# Altium project PCB_AUTO-HANDWASH-THERMOMETER.PrjPcb
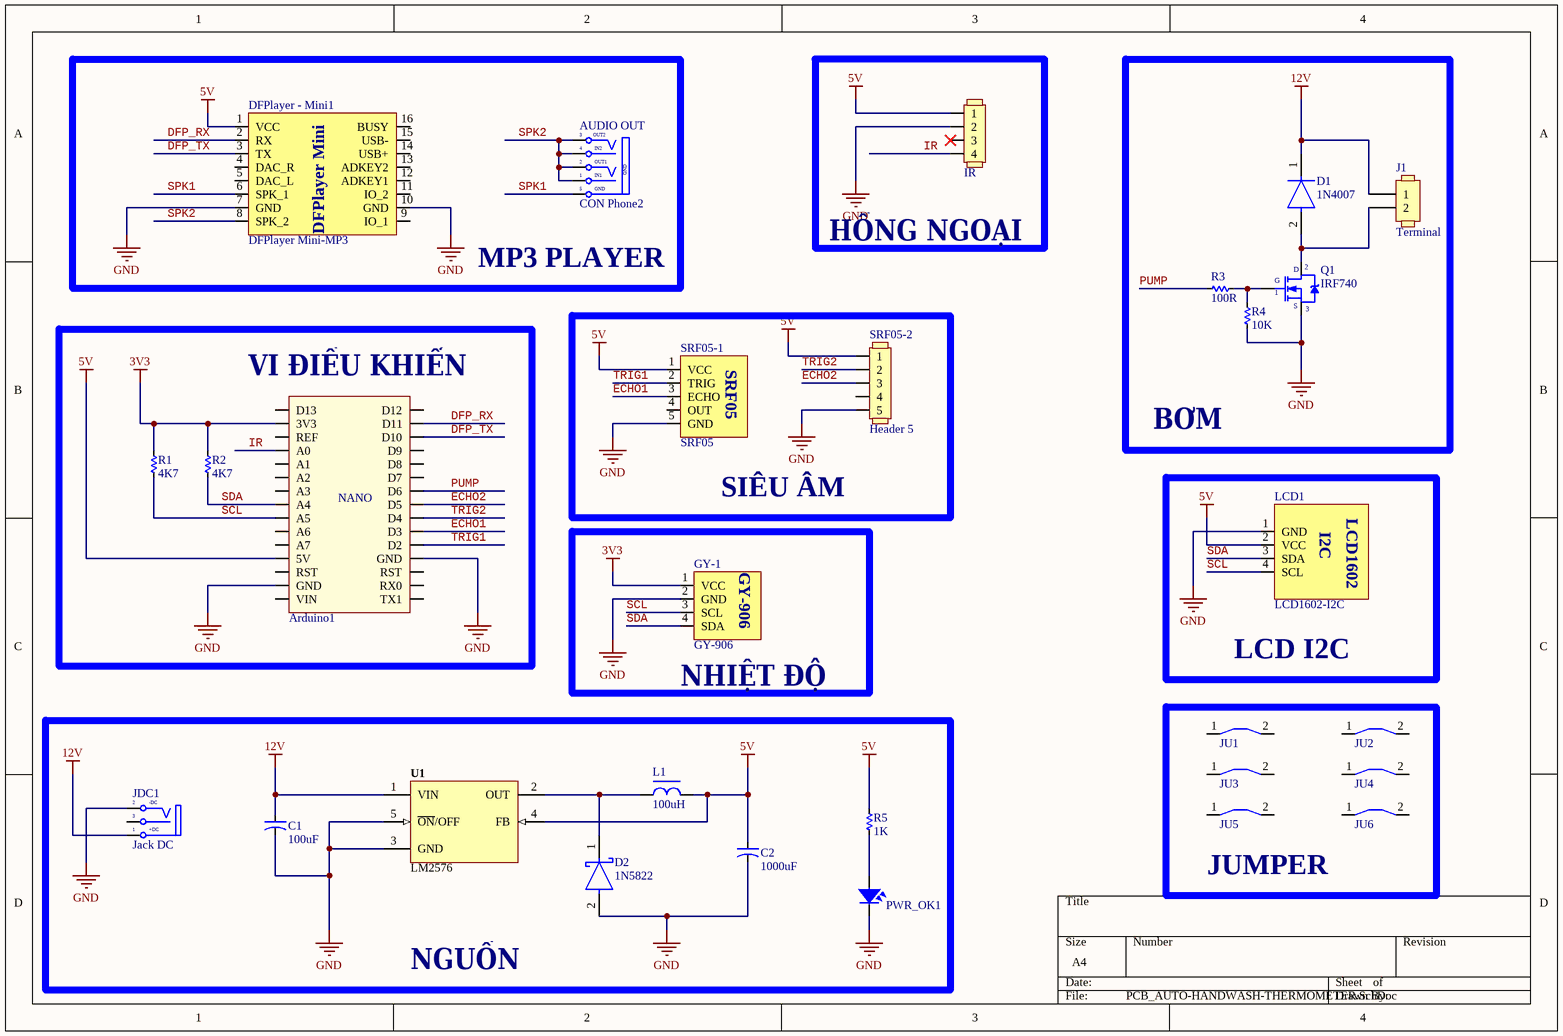
[diagram p0: PCB_AUTO-HANDWASH-THERMOMETER.SchDoc]
1 sheet, 29 parts. Net scope: global (net labels, ports and power ports of the same name join across sheets).
Board file: PCB_AUTO-HANDWASH-THERMOMETER.PcbDoc

## Sheet PCB_AUTO-HANDWASH-THERMOMETER.SchDoc
size A4; SheetNumber: 1; SheetTotal: 1

### Parts
Arduino1  Arduino Nano  [Arduino Nano]  (value not drawn)
AUDIO_OUT  CON Phone2  [CON Phone2]
C1  100uF  [CA-ALU-16]
C2  1000uF  [CA-ALU-16]
D1  1N4007  [FP-1N4007-MFG]
D2  1N5822  [FP-DO-201AD-MFG]
DFPlayer_-_Mini1  DFPlayer Mini-MP3  [DFPlayer Mini]
GY-1  GY-906  [GY-906]
IR  Header 4  [HEADER x4]  (value not drawn)
J1  Terminal  [Terminal x2 5mm]
JDC1  Jack DC  [DC0]
JU1  JUMPER  [JUMPER 15MM]  (value not drawn)
JU2  JUMPER  [JUMPER 10MM]  (value not drawn)
JU3  JUMPER  [JUMPER 5MM]  (value not drawn)
JU4  JUMPER  [JUMPER 5MM]  (value not drawn)
JU5  JUMPER  [JUMPER 5MM]  (value not drawn)
JU6  JUMPER  [JUMPER 5MM]  (value not drawn)
L1  100uH  [L-DIP-M-8]
LCD1  LCD1602-I2C  [LCD1602-I2C]
PWR_OK1  LED  [LED-5-RED]  (value not drawn)
Q1  IRF740  [TO220H1]
R1  4K7  [RES-1/4W]
R2  4K7  [RES-1/4W]
R3  100R  [RES-1/4W]
R4  10K  [RES-1/4W]
R5  1K  [RES-1/4W]
SRF05-1  SRF05  [SRF05]
SRF05-2  Header 5  [HEADER x5]
U1  LM2576  [DIP5-T]

### Blocks framed on the sheet
MP3 PLAYER: AUDIO_OUT DFPlayer_-_Mini1
HỒNG NGOẠI: IR
BƠM: D1 J1 Q1 R3 R4
VI ĐIỀU KHIỂN: Arduino1 R1 R2
SIÊU ÂM: SRF05-1 SRF05-2
LCD I2C: LCD1
NHIỆT ĐỘ: GY-1
NGUỒN: C1 C2 D2 JDC1 L1 PWR_OK1 R5 U1
JUMPER: JU1-JU6

### Nets
3V3: Arduino1.3V3 GY-1.1(VCC) R1.1 R2.1
5V: Arduino1.5V C2.1 DFPlayer_-_Mini1.1(VCC) IR.1 L1.2 LCD1.2(VCC) R5.1 SRF05-1.1(VCC) SRF05-2.1 U1.4(FB)
12V: C1.1 D1.1(C) J1.1 JDC1.1(T) U1.1(VIN)
GND: Arduino1.GND C1.2 C2.2 D2.2(A) DFPlayer_-_Mini1.7(GND) DFPlayer_-_Mini1.10(GND) GY-1.2(GND) IR.2 JDC1.2(TN) LCD1.1(GND) PWR_OK1.2 Q1.3(S) R4.2 SRF05-1.5(GND) SRF05-2.5 U1.3(GND) U1.5(~{ON}/OFF)
DFP_RX: Arduino1.D11 DFPlayer_-_Mini1.2(RX)
DFP_TX: Arduino1.D10 DFPlayer_-_Mini1.3(TX)
ECHO1: Arduino1.D3 SRF05-1.3(ECHO)
ECHO2: Arduino1.D5 SRF05-2.3
IR: Arduino1.A0 IR.4
PUMP: Arduino1.D6 R3.2
SCL: Arduino1.A5 GY-1.3(SCL) LCD1.4(SCL) R1.2
SDA: Arduino1.A4 GY-1.4(SDA) LCD1.3(SDA) R2.2
SPK1: AUDIO_OUT.5(GND) DFPlayer_-_Mini1.6(SPK_1)
SPK2: AUDIO_OUT.1(S1) AUDIO_OUT.2(S1) AUDIO_OUT.3(TN) AUDIO_OUT.4(S) DFPlayer_-_Mini1.8(SPK_2)
TRIG1: Arduino1.D2 SRF05-1.2(TRIG)
TRIG2: Arduino1.D4 SRF05-2.2
NetD1_2: D1.2(A) J1.2 Q1.2(D)
NetD2_1: D2.1(C) L1.1 U1.2(OUT)
NetPWR_OK1_1: PWR_OK1.1 R5.2
NetQ1_1: Q1.1(G) R3.1 R4.1

Not connected (* = marked no-connect by the designer): Arduino1 A1 A2 A3 A6 A7 D7 D8 D9 D12 D13 REF RST RX0 TX1 VIN; DFPlayer_-_Mini1 4(DAC_R) 5(DAC_L) 9(IO_1) 11(IO_2) 12(ADKEY1) 13(ADKEY2) 14(USB+) 15(USB-) 16(BUSY); IR 3*; JDC1 3(S); JU1 1 2; JU2 1 2; JU3 1 2; JU4 1 2; JU5 1 2; JU6 1 2; SRF05-1 4(OUT); SRF05-2 4

### Notes on the sheet
- (in symbol Arduino Nano) NANO
- (in symbol CON Phone2) OUT2; IN2; OUT1; IN1
- (in symbol DCIN) -DC; +DC
- (in symbol DFPlayer Mini-MP3) DFPlayer Mini
- (in symbol LCD1602-I2C) LCD1602; I2C

### Library data of the parts
Arduino1 = Arduino Nano: Value: Cau 1A
AUDIO_OUT = CON Phone2: Jac Phone Stereo; Creat by: VanDungEvn@Gmail.com
C1 C2 = CN-ALU-DIP: Capacitor (Semiconductor SIM Model); Value: 104; LatestRevisionDate: 17-Jul-2002; LatestRevisionNote: Re-released for DXP Platform.; PackageReference: C1206; Publisher: Altium Limited
D1 = CMP-123542-000001-1: Rectifier diode 1000 V 1 A DO-41, ,; Manufacturer: Diotec; Max Surge Forward Current: 27A; Forward Current: 1A; Max Junction Temp: +175°C; Reverse Voltage: 1000V; Value: 15pF; Peak Reverse Current: 5uA; Category: Diode; Temperature Range Low: -50°C; Automotive: No; Temperature: -50°C to +175°C; Lead Free: Yes; ComponentLink2Description: Datasheet; Max Repetitive Reverse Voltage: 1000V; ComponentLink2URL: https://datasheet.octopart.com/1N4007-Diotec-datasheet-62346875.pdf; Manufacturer Part Number: 1N4007; Device Class L3: Rectifier Diodes; Height: 2.8mm; Octopart: https://octopart.com/1n4007-diotec-4040411; Package: 1N4007; Temperature Range High: +175°C; Device Class L1: Discrete Semiconductors; Device Class L2: Diodes; RoHS: TRUE; Capacitance: 15pF; Ipc Land Pattern Name: DIOAD888W100L520D280
D2 = CMP-12187-000025-1: DIODE SCHOTTKY 40V 3A DO201AD; Manufacturer: STMicroelectronics; Max Junction Temp: +150°C; Peak Reverse Current: 2mA; Max Surge Forward Current: 80A; Temperature Range High: +150°C; Automotive: No; RoHS: TRUE; ComponentLink2Description: Datasheet; Manufacturer Part Number: 1N5822; Lead Free: Yes; Octopart: https://octopart.com/1n5822-stmicroelectronics-323225; Device Class L2: Diodes; Max Repetitive Reverse Voltage: 40V; Temperature: to +150°C; Height: 5.3mm; Category: Diode; Digikey Description: DIODE SCHOTTKY 40V 3A DO201AD; ComponentLink2URL: https://www.st.com/resource/en/datasheet/1n5822.pdf; Device Class L3: Schottky Diodes; Device Class L1: Discrete Semiconductors; Forward Current: 3A; Mouser Description: Schottky Diodes & Rectifiers Vr/40V Io/3A BULK; Package: DO-201AD
J1 = Terminal x2
JDC1 = DCIN: Jac DC input; Value: Jac DC
L1 = L-DIP-1: Inductor; Value: 150 mH
PWR_OK1 = LED: LED Single colour Green and Red; Value: LED 3 ly Single Colour
Q1 = IRF840: MOSFET N - CHANNEL 500V - 0.75 - 8A - TO-220; Value: IRF840
R1-R5 = Res: Manufacturer: Generic Components; Class: Passive; SubClass: R; Published: 08/06/2000; Publisher: Altium Hobart Technology Centre
U1 = LM2576: Max Input Voltage: 12 V; Max Output Current: 3 (6.0 peak) A; Max Output Voltage: mV; Category: IC-Power; Min Input Voltage: mV; Min Output Voltage: mV; Mounting Technology: Surface Mount; Status: Unreleased; Supply Voltage: mV; Temperature Range: -40 to +125 degC